# Altium schematic sheet Power and PWR-Managment.SchDoc
size A
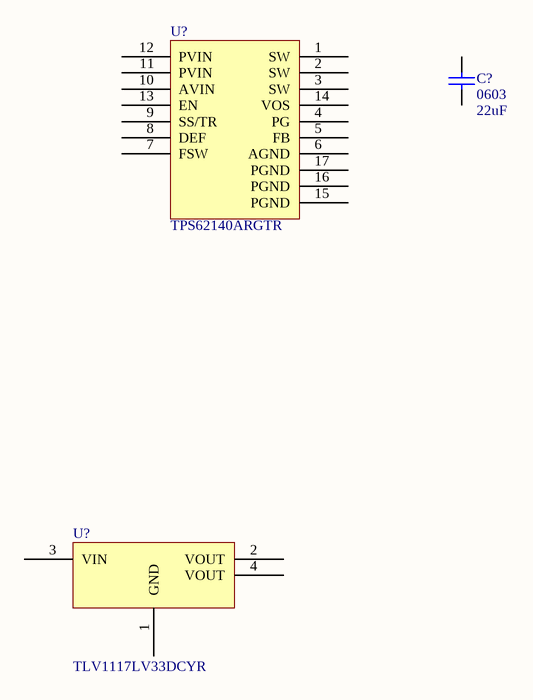
[diagram p0: Power and PWR-Managment.SchDoc]

## Parts
(Parts that share a designator on the sheet are numbered #1, #2 ... from top to bottom, then left to right.)
C?  0603  value 22uF  [C0603]
U?#1  TPS62140ARGTR  [TPS62140ARGTR]
U?#2  TLV1117LV33DCYR  [TLV1117LV - SOT230P700X180-4N]

## Nets

Not connected (* = marked no-connect by the designer): C? 1 2; U?#1 1(SW) 2(SW) 3(SW) 4(PG) 5(FB) 6(AGND) 7(FSW) 8(DEF) 9(SS/TR) 10(AVIN) 11(PVIN) 12(PVIN) 13(EN) 14(VOS) 15(PGND) 16(PGND) 17(PGND); U?#2 1(GND) 2(VOUT) 3(VIN) 4(VOUT)

## Library data of the parts
C? = CL10A226KQ8NRNE: CAP CER 22UF 6.3V X5R 0603; MFR: Samsung Electro-Mechanics America, Inc.; Pin Count #: 2; Tolerance: 10%; Type: Capacitor / Passive; Lead-Free ?: Yes; Designer: Adam Vadala-Roth; MFR #: CL10A226KQ8NRNE; Status: Available; Mounting: SMT; Datasheet: https://media.digikey.com/pdf/Data%20Sheets/Samsung%20PDFs/CL10A226KQ8NRNE_Spec.pdf; Height: 0.9mm; Cost: $0.07416 @ 3000; Voltage: 6.3V; Date Created: 25 Feb 2016; Last Modified: 25 Feb 2016
U?#1 = TPS62140ARGTR: IC REG BUCK ADJ 2A SYNC 16QFN; MFR: Texas Instruments; Pin Count #: 17; Lead-Free ?: Yes; Voltage: 2-10VDC; Designer: Adam Vadala-Roth; MFR #: TPS62140ARGTR; Status: Active; Mounting: SMT/SMD; Datasheet: http://www.ti.com/lit/ds/symlink/tps62140a.pdf; Height: 1mm; Tolerance: *; Cost: 0.99 @ 1000; Type: DCDC Switchign Buck Converter / Voltage Regulator; Date Created: 6 May 2016; Last Modified: 6 May 2016
U?#2 = TLV1117LV33DCYR: IC REG LDO 3.3V 1A SOT223; MFR: Texs Instruments; Pin Count #: 3; Lead-Free ?: Yes; Voltage: 5.5V In 3.3v Out; Designer: Adam Vadala-Roth; MFR #: TLV1117LV33DCYR; Status: Active; Mounting: SMT/SMD; Datasheet: http://www.ti.com/lit/ds/symlink/tlv1117lv.pdf; Height: 1.8mm; Tolerance: *; Cost: 0.27 @ 1000; Type: LDO Low Drop Out Regulators / Voltage Regulator; Date Created: 6 May 2016; Last Modified: 6 May 2016